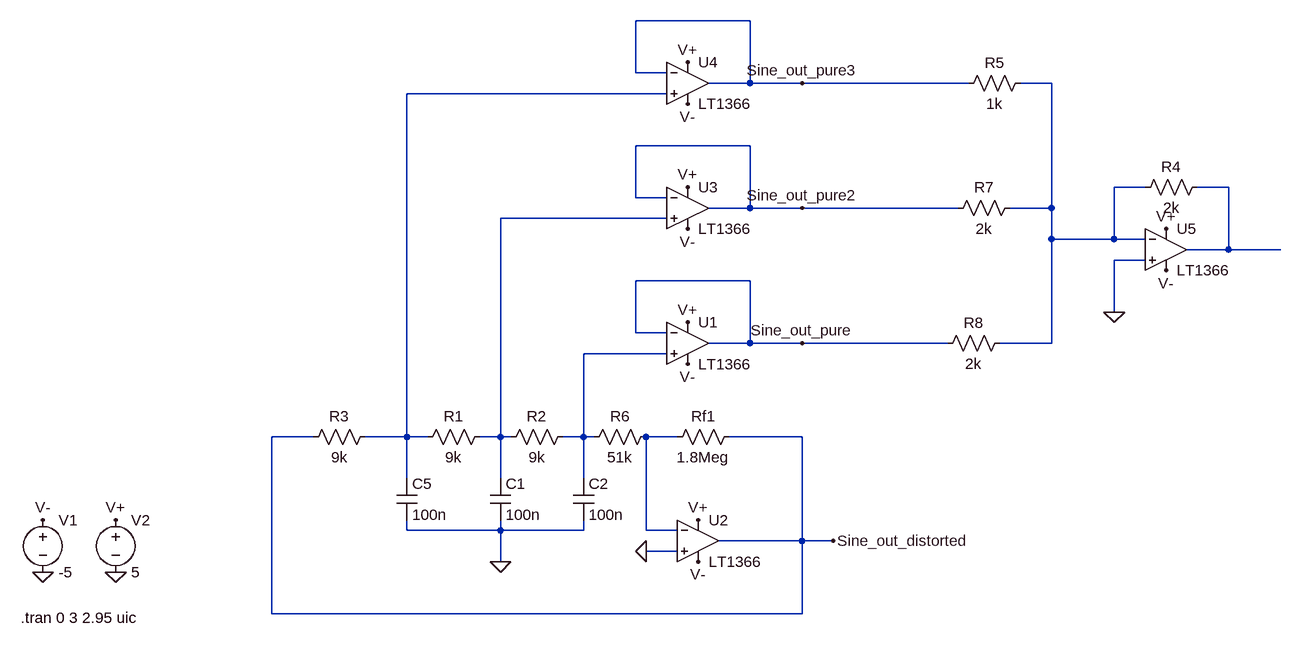
[diagram p0: schematic sinewave_generator.asc]
sinewave_generator.asc, the LTspice schematic file:
Version 4
SHEET 1 2944 680
WIRE 1424 -672 1248 -672
WIRE 1248 -592 1248 -672
WIRE 1296 -592 1248 -592
WIRE 1424 -576 1424 -672
WIRE 1424 -576 1360 -576
WIRE 1504 -576 1424 -576
WIRE 1760 -576 1504 -576
WIRE 1888 -576 1840 -576
WIRE 1296 -560 896 -560
WIRE 1424 -480 1248 -480
WIRE 2032 -416 1984 -416
WIRE 2160 -416 2112 -416
WIRE 1248 -400 1248 -480
WIRE 1296 -400 1248 -400
WIRE 1424 -384 1424 -480
WIRE 1424 -384 1360 -384
WIRE 1504 -384 1424 -384
WIRE 1744 -384 1504 -384
WIRE 1888 -384 1888 -576
WIRE 1888 -384 1824 -384
WIRE 1296 -368 1040 -368
WIRE 1888 -336 1888 -384
WIRE 1984 -336 1984 -416
WIRE 1984 -336 1888 -336
WIRE 2032 -336 1984 -336
WIRE 2160 -320 2160 -416
WIRE 2160 -320 2096 -320
WIRE 2240 -320 2160 -320
WIRE 2032 -304 1984 -304
WIRE 1424 -272 1248 -272
WIRE 1984 -224 1984 -304
WIRE 1248 -192 1248 -272
WIRE 1296 -192 1248 -192
WIRE 1424 -176 1424 -272
WIRE 1424 -176 1360 -176
WIRE 1504 -176 1424 -176
WIRE 1728 -176 1504 -176
WIRE 1888 -176 1888 -336
WIRE 1888 -176 1808 -176
WIRE 1296 -160 1168 -160
WIRE 752 -32 688 -32
WIRE 896 -32 896 -560
WIRE 896 -32 832 -32
WIRE 928 -32 896 -32
WIRE 1040 -32 1040 -368
WIRE 1040 -32 1008 -32
WIRE 1056 -32 1040 -32
WIRE 1168 -32 1168 -160
WIRE 1168 -32 1136 -32
WIRE 1184 -32 1168 -32
WIRE 1312 -32 1264 -32
WIRE 1504 -32 1392 -32
WIRE 896 32 896 -32
WIRE 1040 32 1040 -32
WIRE 1168 32 1168 -32
WIRE 896 112 896 96
WIRE 1040 112 1040 96
WIRE 1040 112 896 112
WIRE 1168 112 1168 96
WIRE 1168 112 1040 112
WIRE 1264 112 1264 -32
WIRE 1312 112 1264 112
WIRE 1504 128 1504 -32
WIRE 1504 128 1376 128
WIRE 1552 128 1504 128
WIRE 1312 144 1264 144
WIRE 1040 160 1040 112
WIRE 688 240 688 -32
WIRE 1504 240 1504 128
WIRE 1504 240 688 240
FLAG 336 176 0
FLAG 448 176 0
FLAG 448 96 V+
FLAG 336 96 V-
FLAG 1344 160 V-
FLAG 1344 96 V+
FLAG 1552 128 Sine_out_distorted
FLAG 1264 144 0
FLAG 1040 160 0
FLAG 1328 -144 V-
FLAG 1328 -208 V+
FLAG 1504 -176 Sine_out_pure
FLAG 1328 -352 V-
FLAG 1328 -416 V+
FLAG 1504 -384 Sine_out_pure2
FLAG 1328 -544 V-
FLAG 1328 -608 V+
FLAG 1504 -576 Sine_out_pure3
FLAG 2064 -288 V-
FLAG 2064 -352 V+
FLAG 1984 -224 0
SYMBOL voltage 336 80 R0
SYMATTR InstName V1
SYMATTR Value -5
SYMBOL voltage 448 80 R0
SYMATTR InstName V2
SYMATTR Value 5
SYMBOL Opamps\\LT1366 1344 64 R0
SYMATTR InstName U2
SYMBOL res 1408 -48 R90
WINDOW 0 0 56 VBottom 2
WINDOW 3 32 56 VTop 2
SYMATTR InstName Rf1
SYMATTR Value 1.8Meg
SYMBOL cap 880 32 R0
SYMATTR InstName C5
SYMATTR Value 100n
SYMBOL res 848 -48 R90
WINDOW 0 0 56 VBottom 2
WINDOW 3 32 56 VTop 2
SYMATTR InstName R3
SYMATTR Value 9k
SYMBOL res 1280 -48 R90
WINDOW 0 0 56 VBottom 2
WINDOW 3 32 56 VTop 2
SYMATTR InstName R6
SYMATTR Value 51k
SYMBOL Opamps\\LT1366 1328 -240 R0
SYMATTR InstName U1
SYMBOL cap 1024 32 R0
SYMATTR InstName C1
SYMATTR Value 100n
SYMBOL cap 1152 32 R0
SYMATTR InstName C2
SYMATTR Value 100n
SYMBOL res 1024 -48 R90
WINDOW 0 0 56 VBottom 2
WINDOW 3 32 56 VTop 2
SYMATTR InstName R1
SYMATTR Value 9k
SYMBOL res 1152 -48 R90
WINDOW 0 0 56 VBottom 2
WINDOW 3 32 56 VTop 2
SYMATTR InstName R2
SYMATTR Value 9k
SYMBOL Opamps\\LT1366 1328 -448 R0
SYMATTR InstName U3
SYMBOL Opamps\\LT1366 1328 -640 R0
SYMATTR InstName U4
SYMBOL Opamps\\LT1366 2064 -384 R0
SYMATTR InstName U5
SYMBOL res 2128 -432 R90
WINDOW 0 0 56 VBottom 2
WINDOW 3 32 56 VTop 2
SYMATTR InstName R4
SYMATTR Value 2k
SYMBOL res 1856 -592 R90
WINDOW 0 0 56 VBottom 2
WINDOW 3 32 56 VTop 2
SYMATTR InstName R5
SYMATTR Value 1k
SYMBOL res 1840 -400 R90
WINDOW 0 0 56 VBottom 2
WINDOW 3 32 56 VTop 2
SYMATTR InstName R7
SYMATTR Value 2k
SYMBOL res 1824 -192 R90
WINDOW 0 0 56 VBottom 2
WINDOW 3 32 56 VTop 2
SYMATTR InstName R8
SYMATTR Value 2k
TEXT 302 246 Left 2 !.tran 0 3 2.95 uic

The netlist it stands for:
* sinewave_generator.asc
V1 V- 0 -5
V2 V+ 0 5
XU2 0 N006 V+ V- Sine_out_distorted LT1366  ; pins In+ In- V+ V- OUT
Rf1 Sine_out_distorted N006 1.8Meg
C5 N002 0 100n
R3 N002 Sine_out_distorted 9k
R6 N006 N005 51k
XU1 N005 Sine_out_pure V+ V- Sine_out_pure LT1366  ; pins In+ In- V+ V- OUT
C1 N004 0 100n
C2 N005 0 100n
R1 N004 N002 9k
R2 N005 N004 9k
XU3 N004 Sine_out_pure2 V+ V- Sine_out_pure2 LT1366  ; pins In+ In- V+ V- OUT
XU4 N002 Sine_out_pure3 V+ V- Sine_out_pure3 LT1366  ; pins In+ In- V+ V- OUT
XU5 0 N001 V+ V- N003 LT1366  ; pins In+ In- V+ V- OUT
R4 N003 N001 2k
R5 N001 Sine_out_pure3 1k
R7 N001 Sine_out_pure2 2k
R8 N001 Sine_out_pure 2k
.tran 0 3 2.95 uic
.lib LTC.lib
.backanno
.end